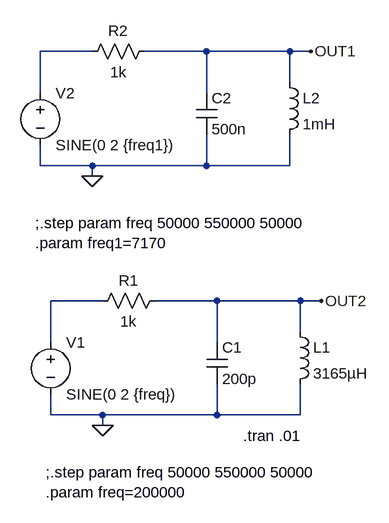
[diagram p0: schematic CircuitBouchon2.asc]
CircuitBouchon2.asc, the LTspice schematic file:
Version 4
SHEET 1 880 680
WIRE 112 -304 32 -304
WIRE 288 -304 192 -304
WIRE 416 -304 288 -304
WIRE 448 -304 416 -304
WIRE 416 -256 416 -304
WIRE 32 -240 32 -304
WIRE 288 -240 288 -304
WIRE 32 -128 32 -160
WIRE 112 -128 32 -128
WIRE 288 -128 288 -176
WIRE 288 -128 112 -128
WIRE 416 -128 416 -176
WIRE 416 -128 288 -128
WIRE 112 -112 112 -128
WIRE 128 80 48 80
WIRE 304 80 208 80
WIRE 432 80 304 80
WIRE 464 80 432 80
WIRE 432 128 432 80
WIRE 48 144 48 80
WIRE 304 144 304 80
WIRE 48 256 48 224
WIRE 128 256 48 256
WIRE 304 256 304 208
WIRE 304 256 128 256
WIRE 432 256 432 208
WIRE 432 256 304 256
WIRE 128 272 128 256
FLAG 128 272 0
FLAG 464 80 OUT2
FLAG 112 -112 0
FLAG 448 -304 OUT1
SYMBOL voltage 48 128 R0
WINDOW 123 0 0 Left 0
WINDOW 39 0 0 Left 0
SYMATTR InstName V1
SYMATTR Value SINE(0 2 {freq})
SYMBOL res 224 64 R90
WINDOW 0 0 56 VBottom 2
WINDOW 3 32 56 VTop 2
SYMATTR InstName R1
SYMATTR Value 1k
SYMBOL cap 288 144 R0
SYMATTR InstName C1
SYMATTR Value 200p
SYMBOL ind 416 112 R0
SYMATTR InstName L1
SYMATTR Value 3165µH
SYMBOL voltage 32 -256 R0
WINDOW 123 0 0 Left 0
WINDOW 39 0 0 Left 0
SYMATTR InstName V2
SYMATTR Value SINE(0 2 {freq1})
SYMBOL res 208 -320 R90
WINDOW 0 0 56 VBottom 2
WINDOW 3 32 56 VTop 2
SYMATTR InstName R2
SYMATTR Value 1k
SYMBOL cap 272 -240 R0
SYMATTR InstName C2
SYMATTR Value 500n
SYMBOL ind 400 -272 R0
SYMATTR InstName L2
SYMATTR Value 1mH
TEXT 344 288 Left 2 !.tran .01
TEXT 40 344 Left 2 !;.step param freq 50000 550000 50000\n.param freq=200000
TEXT 24 -40 Left 2 !;.step param freq 50000 550000 50000\n.param freq1=7170

The netlist it stands for:
* CircuitBouchon2.asc
V1 N002 0 SINE(0 2 {freq})
R1 OUT2 N002 1k
C1 OUT2 0 200p
L1 OUT2 0 3165µH
V2 N001 0 SINE(0 2 {freq1})
R2 OUT1 N001 1k
C2 OUT1 0 500n
L2 OUT1 0 1mH
.tran .01
;.step param freq 50000 550000 50000
.param freq=200000
;.step param freq 50000 550000 50000
.param freq1=7170
.backanno
.end